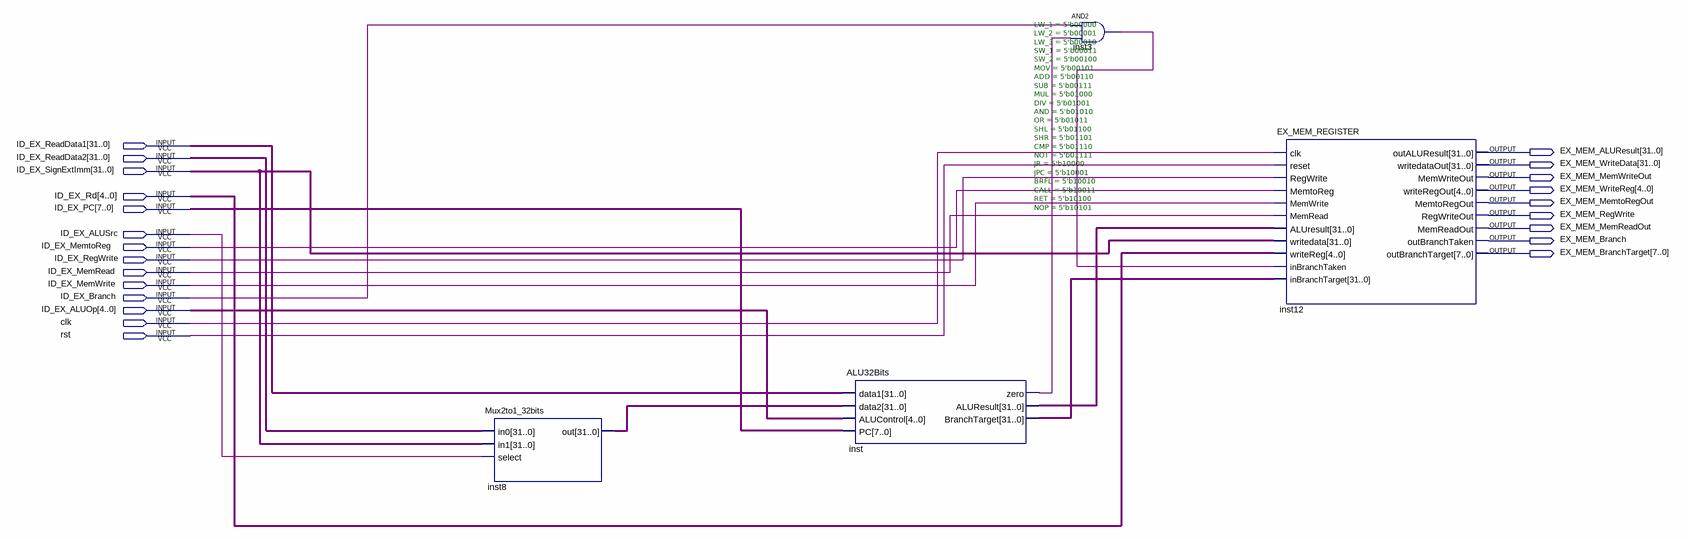
[diagram p0: schematic sheet]
// Quartus schematic EX_STAGE.bdf as structural Verilog: 4 symbols, 23 pins
module EX_STAGE (
  input  [31:0] ID_EX_ReadData1,
  input  [31:0] ID_EX_ReadData2,
  input  [31:0] ID_EX_SignExtImm,
  input  [4:0] ID_EX_Rd,
  input  [7:0] ID_EX_PC,
  input  ID_EX_ALUSrc,
  input  ID_EX_MemtoReg,
  input  ID_EX_RegWrite,
  input  ID_EX_MemRead,
  input  ID_EX_MemWrite,
  input  ID_EX_Branch,
  input  [4:0] ID_EX_ALUOp,
  input  clk,
  input  rst,
  output [31:0] EX_MEM_ALUResult,
  output [31:0] EX_MEM_WriteData,
  output EX_MEM_MemWriteOut,
  output [4:0] EX_MEM_WriteReg,
  output EX_MEM_MemtoRegOut,
  output EX_MEM_RegWrite,
  output EX_MEM_MemReadOut,
  output EX_MEM_Branch,
  output [7:0] EX_MEM_BranchTarget
);

  wire inst3_out, inst_zero;
  wire [31:0] inst8_out, inst_aluresult, inst_branchtarget;

  Mux2to1_32bits inst8 (.in0(ID_EX_ReadData2), .in1(ID_EX_SignExtImm), .select(ID_EX_ALUSrc), .out(inst8_out));
  ALU32Bits #(.LW_1(5'b00000), .LW_2(5'b00001), .LW_3(5'b00010), .SW_1(5'b00011), .SW_2(5'b00100), .MOV(5'b00101), .ADD(5'b00110), .SUB(5'b00111), .MUL(5'b01000), .DIV(5'b01001), .AND(5'b01010), .OR(5'b01011), .SHL(5'b01100), .SHR(5'b01101), .CMP(5'b01110), .NOT(5'b01111), .JR(5'b10000), .JPC(5'b10001), .BRFL(5'b10010), .CALL(5'b10011), .RET(5'b10100), .NOP(5'b10101)) inst (
    .data1(ID_EX_ReadData1), .data2(inst8_out), .ALUControl(ID_EX_ALUOp), .PC(ID_EX_PC), .zero(inst_zero),
    .ALUResult(inst_aluresult), .BranchTarget(inst_branchtarget));
  and inst3 (inst3_out, ID_EX_Branch, inst_zero);
  EX_MEM_REGISTER inst12 (
    .clk(clk), .reset(rst), .RegWrite(ID_EX_RegWrite), .MemtoReg(ID_EX_MemtoReg), .MemWrite(ID_EX_MemWrite),
    .MemRead(ID_EX_MemRead), .ALUresult(inst_aluresult), .writedata(ID_EX_SignExtImm), .writeReg(ID_EX_Rd),
    .inBranchTaken(inst3_out), .inBranchTarget(inst_branchtarget), .outALUResult(EX_MEM_ALUResult),
    .writedataOut(EX_MEM_WriteData), .MemWriteOut(EX_MEM_MemWriteOut), .writeRegOut(EX_MEM_WriteReg),
    .MemtoRegOut(EX_MEM_MemtoRegOut), .RegWriteOut(EX_MEM_RegWrite), .MemReadOut(EX_MEM_MemReadOut),
    .outBranchTaken(EX_MEM_Branch), .outBranchTarget(EX_MEM_BranchTarget));
endmodule
